# Altium schematic sheet SD_Card_Schematic.SchDoc
size A3; SheetNumber: 3; SheetTotal: 3
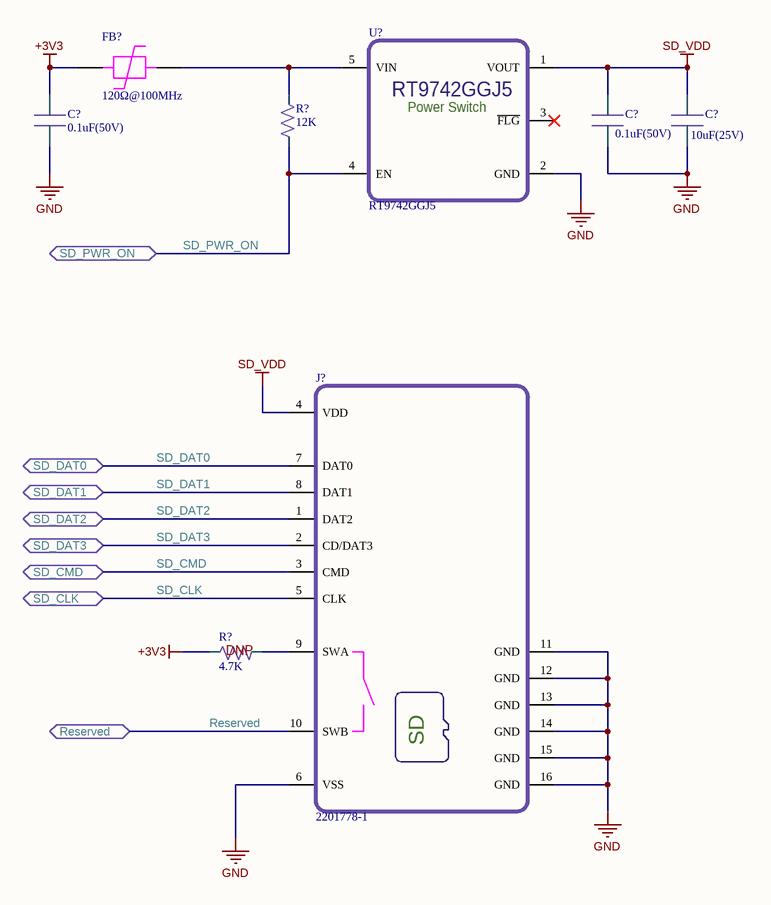
[diagram p0: SD_Card_Schematic.SchDoc]

## Parts
(Parts that share a designator on the sheet are numbered #1, #2 ... from top to bottom, then left to right.)
C?#1  0.1uF(50V)  [Capacitor_0603]
C?#2  0.1uF(50V)  [Capacitor_0603]
C?#3  10uF(25V)  [Capacitor_0603]
FB?  120Ω@100MHz  [FB0402]
J?  2201778-1
R?#1  12K  [RESISTOR_0402]
R?#2  4.7K  [RESISTOR_0402]
U?  RT9742GGJ5  [SOT23-5]

## Ports
Reserved (bidir), SD_CLK (bidir), SD_CMD (bidir), SD_DAT0 (bidir), SD_DAT1 (bidir), SD_DAT2 (bidir), SD_DAT3 (bidir), SD_PWR_ON (bidir)

## Nets
+3V3: C?#1.2 FB?.1 R?#2.2
GND: C?#1.1 C?#2.1 C?#3.1 J?.6(VSS) J?.11(GND) J?.12(GND) J?.13(GND) J?.14(GND) J?.15(GND) J?.16(GND) U?.2(GND)
SD_VDD: C?#2.2 C?#3.2 J?.4(VDD) U?.1(VOUT)
Reserved: J?.10(SWB) ; port Reserved
SD_CLK: J?.5(CLK) ; port SD_CLK
SD_CMD: J?.3(CMD) ; port SD_CMD
SD_DAT0: J?.7(DAT0) ; port SD_DAT0
SD_DAT1: J?.8(DAT1) ; port SD_DAT1
SD_DAT2: J?.1(DAT2) ; port SD_DAT2
SD_DAT3: J?.2(CD/DAT3) ; port SD_DAT3
SD_PWR_ON: R?#1.1 U?.4(EN) ; port SD_PWR_ON
NetFB?_2: FB?.2 R?#1.2 U?.5(VIN)
NetJ?_9: J?.9(SWA) R?#2.1

Not connected (* = marked no-connect by the designer): U? 3(~{FLG})*

## Notes on the sheet
- (near R?#2) DNP
- (in symbol 2201778-1) SD
- (in symbol RT9742GGJ5) Power Switch

## Library data of the parts
C?#1 C?#2 = GCJ188R71H104KA12D: 50V 100nF X7R ±10% 0603 Multilayer Ceramic Capacitors MLCC - SMD/SMT ROHS; Manufacturer: Murata; MinTemp: -55°C; MaxTemp: 125 °C; ManufacturerPartNumber: GCJ188R71H104KA12D; SupplierPartNumber: C161115; Supplier: LCSC; Price: 0.83; ComponentLink1Description: SupplierURL; ComponentLink1URL: https://www.lcsc.com/product-detail/Multilayer-Ceramic-Capacitors-MLCC-SMD-SMT_Murata-Electronics-GCJ188R71H104KA12D_C161115.html
C?#3 = C0603X5R106K250NT: 25V 10uF ±10% 0603 Multilayer Ceramic Capacitors MLCC - SMD/SMT ROHS; Manufacturer: sanyear; MinTemp: -55 C; MaxTemp: 125 C; ManufacturerPartNumber: C0603X5R106K250NT; SupplierPartNumber: C729457; Supplier: LCSC; Price: 0.0390; ComponentLink1Description: SupplierURL; ComponentLink1URL: https://www.lcsc.com/product-detail/Multilayer-Ceramic-Capacitors-MLCC-SMD-SMT_SANYEAR-C0603X5R106K250NT_C729457.html
FB? = BLM15KD121SN1D: 1.5A 1 70mΩ 120Ω@100MHz ±25% 0402 Ferrite Beads ROHS; Manufacturer: Murata Electronics; MinTemp: -55°C; MaxTemp: +125°C; ManufacturerPartNumber: BLM15KD121SN1D; SupplierPartNumber: C710343; Supplier: LCSC; Price: 0.0169; ComponentLink1Description: SupplierURL; ComponentLink1URL: https://lcsc.com/product-detail/Ferrite-Beads_Murata-Electronics-BLM15KD121SN1D_C710343.html
J? = 2201778-1: - SD Card Connectors ROHS; Manufacturer: TE Connectivity; ManufacturerPartNumber: 2201778-1; SupplierPartNumber: C590836; Supplier: LCSC; MinTemp: *; MaxTemp: *; Price: 2.2941; ComponentLink1Description: SupplierURL; ComponentLink1URL: https://www.lcsc.com/product-detail/span-style-background-color-ff0-SD-span-span-style-background-color-ff0-Card-span-Connectors_TE-Connectivity-2201778-1_C590836.html
R?#1 = HPCR0402F12K0K9: ±1% 100mW Thick Film Resistors 50V ±100ppm/℃ 12kΩ -55℃~+125℃ 0402 Chip Resistor - Surface Mount ROHS; Manufacturer: Resistor.Today; MinTemp: -55℃; MaxTemp: +125℃; ManufacturerPartNumber: HPCR0402F12K0K9; SupplierPartNumber: C363271; Supplier: LCSC; Price: 0.0074; ComponentLink1Description: SupplierURL; ComponentLink1URL: https://lcsc.com/product-detail/Chip-Resistor-Surface-Mount_Resistor-Today-HPCR0402F12K0K9_C363271.html
R?#2 = ERJPA2F4701X: ±1% 200mW ±100ppm/℃ -55℃~+155℃ 4.7kΩ 0402 Chip Resistor - Surface Mount ROHS; Manufacturer: PANASONIC; MinTemp: -55℃; MaxTemp: +155℃; ManufacturerPartNumber: ERJPA2F4701X; SupplierPartNumber: C427244; Supplier: LCSC; Price: 0.0477; ComponentLink1Description: SupplierURL; ComponentLink1URL: https://lcsc.com/product-detail/Chip-Resistor-Surface-Mount_PANASONIC-ERJPA2F4701X_C427244.html
U? = RT9742GGJ5: TSOT-23-5 Power Distribution Switches ROHS; Manufacturer: Richtek; ManufacturerPartNumber: RT9742GGJ5; SupplierPartNumber: C250547; Supplier: LCSC; MinTemp: *; MaxTemp: *; Price: 1.3062; ComponentLink1Description: SupplierURL; ComponentLink1URL: https://www.lcsc.com/product-detail/Power-Distribution-Switches_Richtek-Tech-RT9742GGJ5_C250547.html